# EAGLE design 18F2550 Trainer (EAGLE 5.11)
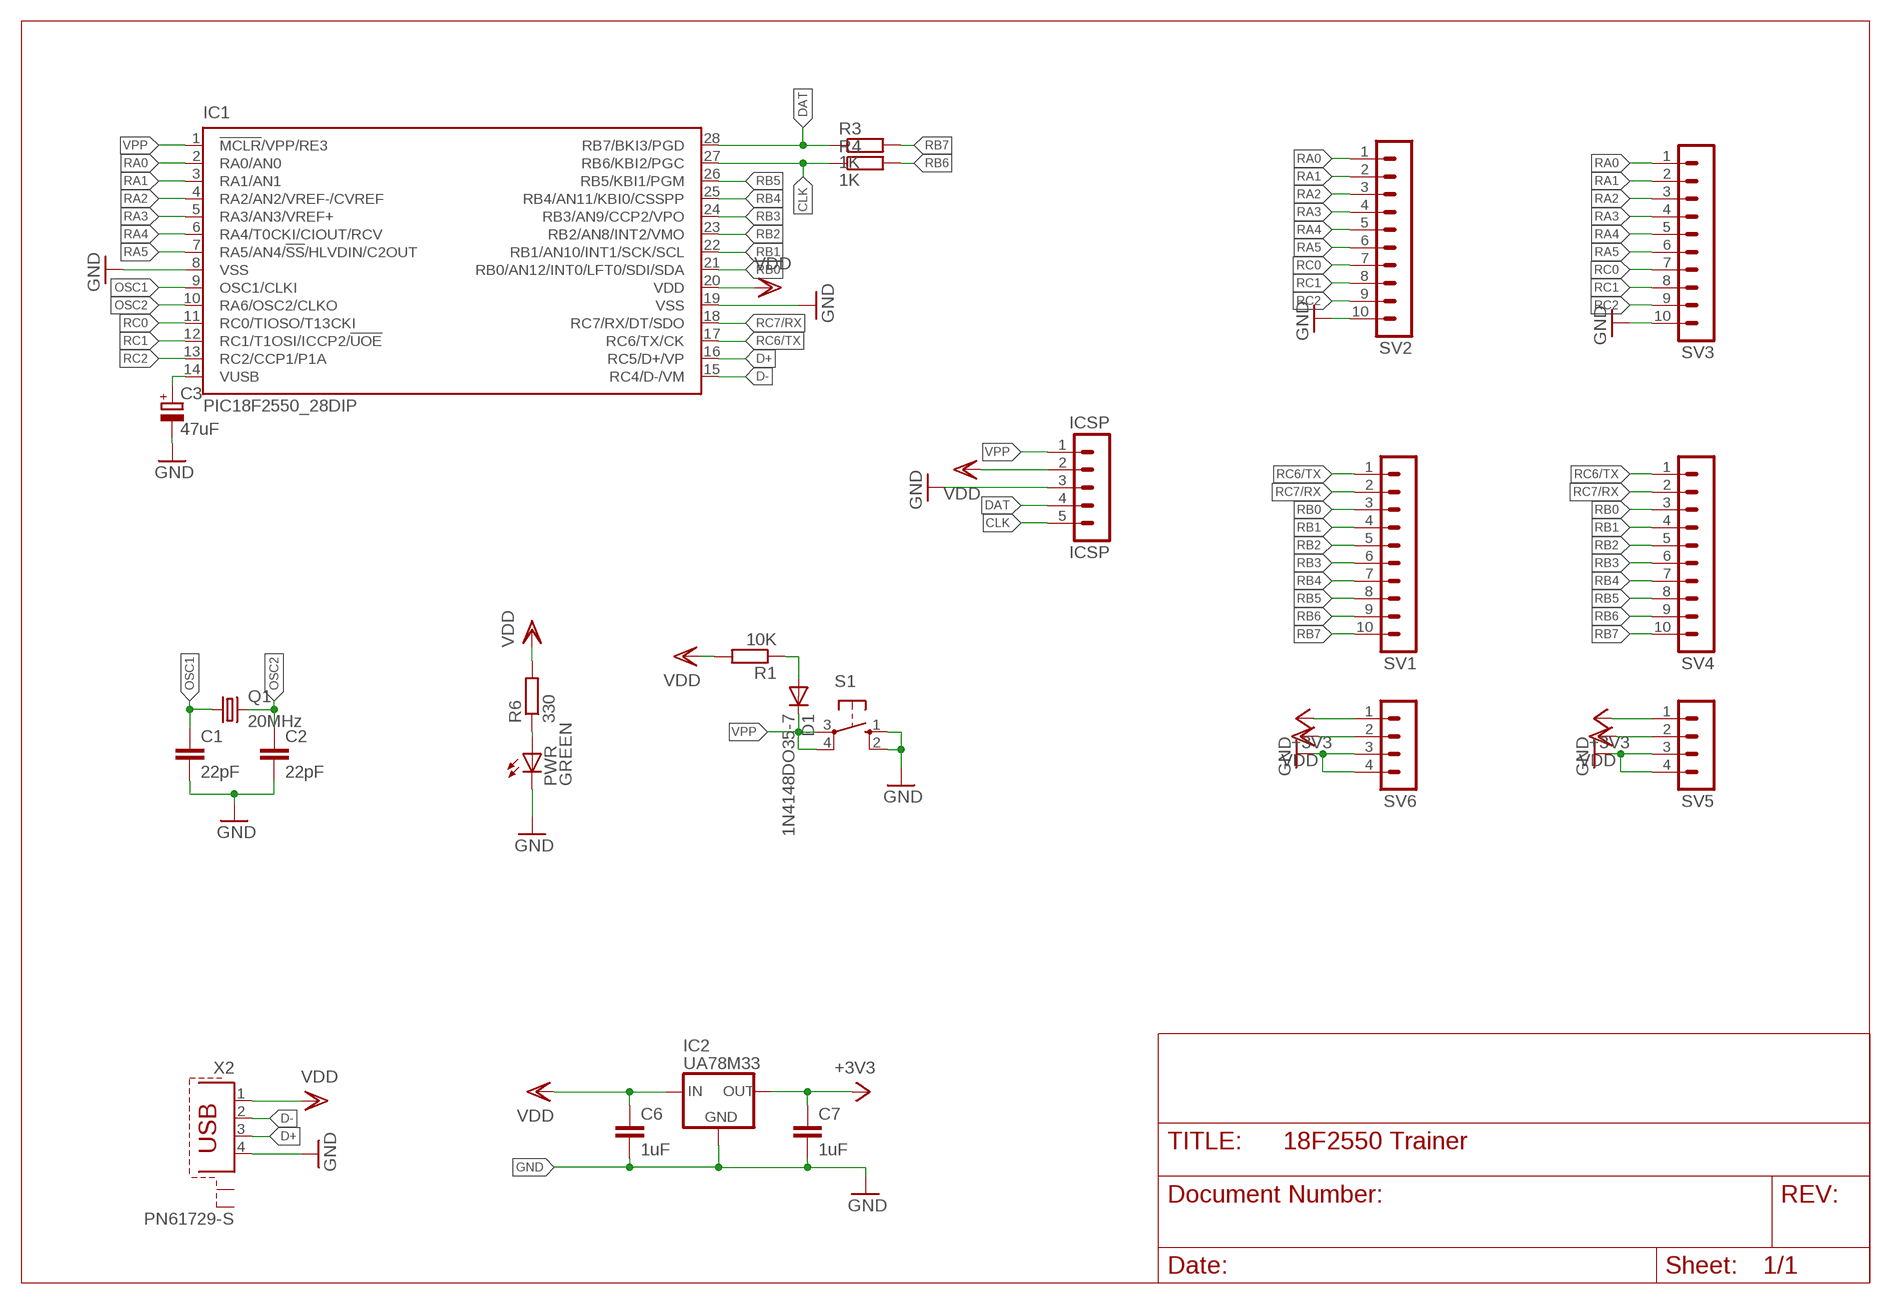
[diagram p0: schematic, sheet 1]

## Parts
C1  22pF  C-EU025-025X050  [C025-025X050]
C2  22pF  C-EU025-025X050  [C025-025X050]
C3  47uF  CPOL-EUE2-5  [E2-5]
C6  1uF  C-EU025-025X050  [C025-025X050]
C7  1uF  C-EU025-025X050  [C025-025X050]
D1  1N4148DO35-7  [DO35-7]
IC1  PIC18F2550_28DIP  [DIL28-3]
IC2  UA78M33  78LXXDPACK  [DPACK]
ICSP  ICSP  MA05-1  [MA05-1]
PWR  GREEN  LED3MM  [LED3MM]
Q1  20MHz  CRYSTALHC49S  [HC49/S]
R1  10K  R-EU_0207/7  [0207/7]
R3  1K  R-EU_0207/7  [0207/7]
R4  1K  R-EU_0207/7  [0207/7]
R6  330  R-EU_0207/7  [0207/7]
S1  10-XX  [B3F-10XX]
SV1  MA10-1  [MA10-1]
SV2  MA10-1  [MA10-1]
SV3  MA10-1  [MA10-1]
SV4  MA10-1  [MA10-1]
SV5  MA04-1  [MA04-1]
SV6  MA04-1  [MA04-1]
X2  PN61729-S  [PN61729-S]

## Nets
+3V3: C7.1 IC2.3(OUT) SV5.1 SV6.1
CLK: IC1.27(RB6/KBI2/PGC) ICSP.5 R4.1
D+: IC1.16(RC5/D+/VP) X2.3
D-: IC1.15(RC4/D-/VM) X2.2
DAT: IC1.28(RB7/BKI3/PGD) ICSP.4 R3.1
GND: C1.2 C2.2 C3.- C6.2 C7.2 IC1.8(VSS) IC1.19(VSS) IC2.4(GND) ICSP.3 PWR.K(C) S1.1(S) S1.2(S1) SV2.10 SV3.10 SV5.3 SV5.4 SV6.3 SV6.4 X2.4
N$1: C3.+ IC1.14(VUSB)
N$6: D1.A R1.1
N$10: PWR.A R6.1
OSC1: C1.1 IC1.9(OSC1/CLKI) Q1.1
OSC2: C2.1 IC1.10(RA6/OSC2/CLKO) Q1.2
RA0: IC1.2(RA0/AN0) SV2.1 SV3.1
RA1: IC1.3(RA1/AN1) SV2.2 SV3.2
RA2: IC1.4(RA2/AN2/VREF-/CVREF) SV2.3 SV3.3
RA3: IC1.5(RA3/AN3/VREF+) SV2.4 SV3.4
RA4: IC1.6(RA4/T0CKI/CIOUT/RCV) SV2.5 SV3.5
RA5: IC1.7(RA5/AN4/!SS!/HLVDIN/C2OUT) SV2.6 SV3.6
RB0: IC1.21(RB0/AN12/INT0/LFT0/SDI/SDA) SV1.3 SV4.3
RB1: IC1.22(RB1/AN10/INT1/SCK/SCL) SV1.4 SV4.4
RB2: IC1.23(RB2/AN8/INT2/VMO) SV1.5 SV4.5
RB3: IC1.24(RB3/AN9/CCP2/VPO) SV1.6 SV4.6
RB4: IC1.25(RB4/AN11/KBI0/CSSPP) SV1.7 SV4.7
RB5: IC1.26(RB5/KBI1/PGM) SV1.8 SV4.8
RB6: R4.2 SV1.9 SV4.9
RB7: R3.2 SV1.10 SV4.10
RC0: IC1.11(RC0/TIOSO/T13CKI) SV2.7 SV3.7
RC1: IC1.12(RC1/T1OSI/ICCP2/!UOE) SV2.8 SV3.8
RC2: IC1.13(RC2/CCP1/P1A) SV2.9 SV3.9
RC6/TX: IC1.17(RC6/TX/CK) SV1.1 SV4.1
RC7/RX: IC1.18(RC7/RX/DT/SDO) SV1.2 SV4.2
VDD: C6.1 IC1.20(VDD) IC2.1(IN) ICSP.2 R1.2 R6.2 SV5.2 SV6.2 X2.1
VPP: D1.C IC1.1(!MCLR!/VPP/RE3) ICSP.1 S1.3(P) S1.4(P1)
Unconnected: X2.S1 X2.S2

## Library data of the parts
C1 C2 C6 C7 = rcl:C-EU: CAPACITOR, European symbol
C3 = rcl:CPOL-EU: POLARIZED CAPACITOR, European symbol
D1 = diode:1N4148: DIODE high speed (Philips)
IC1 = microchip:PIC18F2*_28: USB Microcontrollers with nanoWatt Technology High-Performance, Enhanced Flash, 28/40/44-Pin, Source: http://ww1.microchip.com/downloads/en/devicedoc/39632c.pdf; MF: MICROCHIP; MPN: PIC18F2550-I/SP; OC_FARNELL: 1523822; OC_NEWARK: 80K6054
IC2 = v-reg:78LXX: VOLTAGE REGULATOR
ICSP = con-lstb:MA05-1: PIN HEADER; OC_FARNELL: unknown; OC_NEWARK: unknown
PWR = led:LED: LED OSRAM: - CHIPLED LG R971, LG N971, LY N971, LG Q971, LY Q971, LO R971, LY R971 LH N974, LH R974 LS Q976, LO Q976, LY Q976 LO Q996 - Hyper CHIPLED LW Q18S LB Q993, LB Q99A, LB R99A - SideLED LS A670, LO A670, LY A670, LG A670, LP A670 LB A673, LV A673, LT A673, LW A673 LH A674 LY A675 LS A676, LA A676, LO A676, LY A676, LW A676 LS A679, LY A679, LG A679 - Hyper Micro SIDELED® LS Y876, LA Y876, LO Y876, LY Y876 LT Y87S - SmartLED LW L88C, LW L88S LB L89C, LB L89S, LG L890 LS L89K, LO L89K, LY L89K LS L896, LA L896, LO L896, LY L896 - TOPLED LS T670, LO T670, LY T670, LG T670, LP T670 LSG T670, LSP T670, LSY T670, LOP T670, LYG T670 LG T671, LOG T671, LSG T671 LB T673, LV T673, LT T673, LW T673 LH T674 LS T676, LA T676, LO T676, LY T676, LB T676, LH T676, LSB T676, LW T676 LB T67C, LV T67C, LT T67C, LS T67K, LO T67K, LY T67K, LW E67C LS E67B, LA E67B, LO E67B, LY E67B, LB E67C, LV E67C, LT E67C LW T67C LS T679, LY T679, LG T679 LS T770, LO T770, LY T770, LG T770, LP T770 LB T773, LV T773, LT T773, LW T773 LH T774 LS E675, LA E675, LY E675, LS T675 LS T776, LA T776, LO T776, LY T776, LB T776 LHGB T686 LT T68C, LB T68C - Hyper Mini TOPLED® LB M676 - Mini TOPLED Santana® LG M470 LS M47K, LO M47K, LY M47K Source: http://www.osram.convergy.de LUXEON: - LUMILED® LXK2-PW12-R00, LXK2-PW12-S00, LXK2-PW14-U00, LXK2-PW14-V00 LXK2-PM12-R00, LXK2-PM12-S00, LXK2-PM14-U00 LXK2-PE12-Q00, LXK2-PE12-R00, LXK2-PE12-S00, LXK2-PE14-T00, LXK2-PE14-U00 LXK2-PB12-K00, LXK2-PB12-L00, LXK2-PB12-M00, LXK2-PB14-N00, LXK2-PB14-P00, LXK2-PB14-Q00 LXK2-PR12-L00, LXK2-PR12-M00, LXK2-PR14-Q00, LXK2-PR14-R00 LXK2-PD12-Q00, LXK2-PD12-R00, LXK2-PD12-S00 LXK2-PH12-R00, LXK2-PH12-S00 LXK2-PL12-P00, LXK2-PL12-Q00, LXK2-PL12-R00 Source: www.luxeon.com KINGBRIGHT: KA-3528ASYC Source: www.kingbright.com
Q1 = crystal:CRYSTAL: CRYSTAL; OC_FARNELL: 1667008; OC_NEWARK: unknown
R1 R3 R4 R6 = rcl:R-EU_: RESISTOR, European symbol
S1 = switch-omron:10-XX: OMRON SWITCH; MPN: B3F-1000; OC_FARNELL: 176432; OC_NEWARK: 36M3542
SV1-SV4 = con-lstb:MA10-1: PIN HEADER; OC_FARNELL: unknown; OC_NEWARK: unknown
SV5 SV6 = con-lstb:MA04-1: PIN HEADER; OC_FARNELL: unknown; OC_NEWARK: unknown
X2 = con-berg:PN61729-S: BERG USB connector; OC_FARNELL: unknown; OC_NEWARK: unknown

## Board
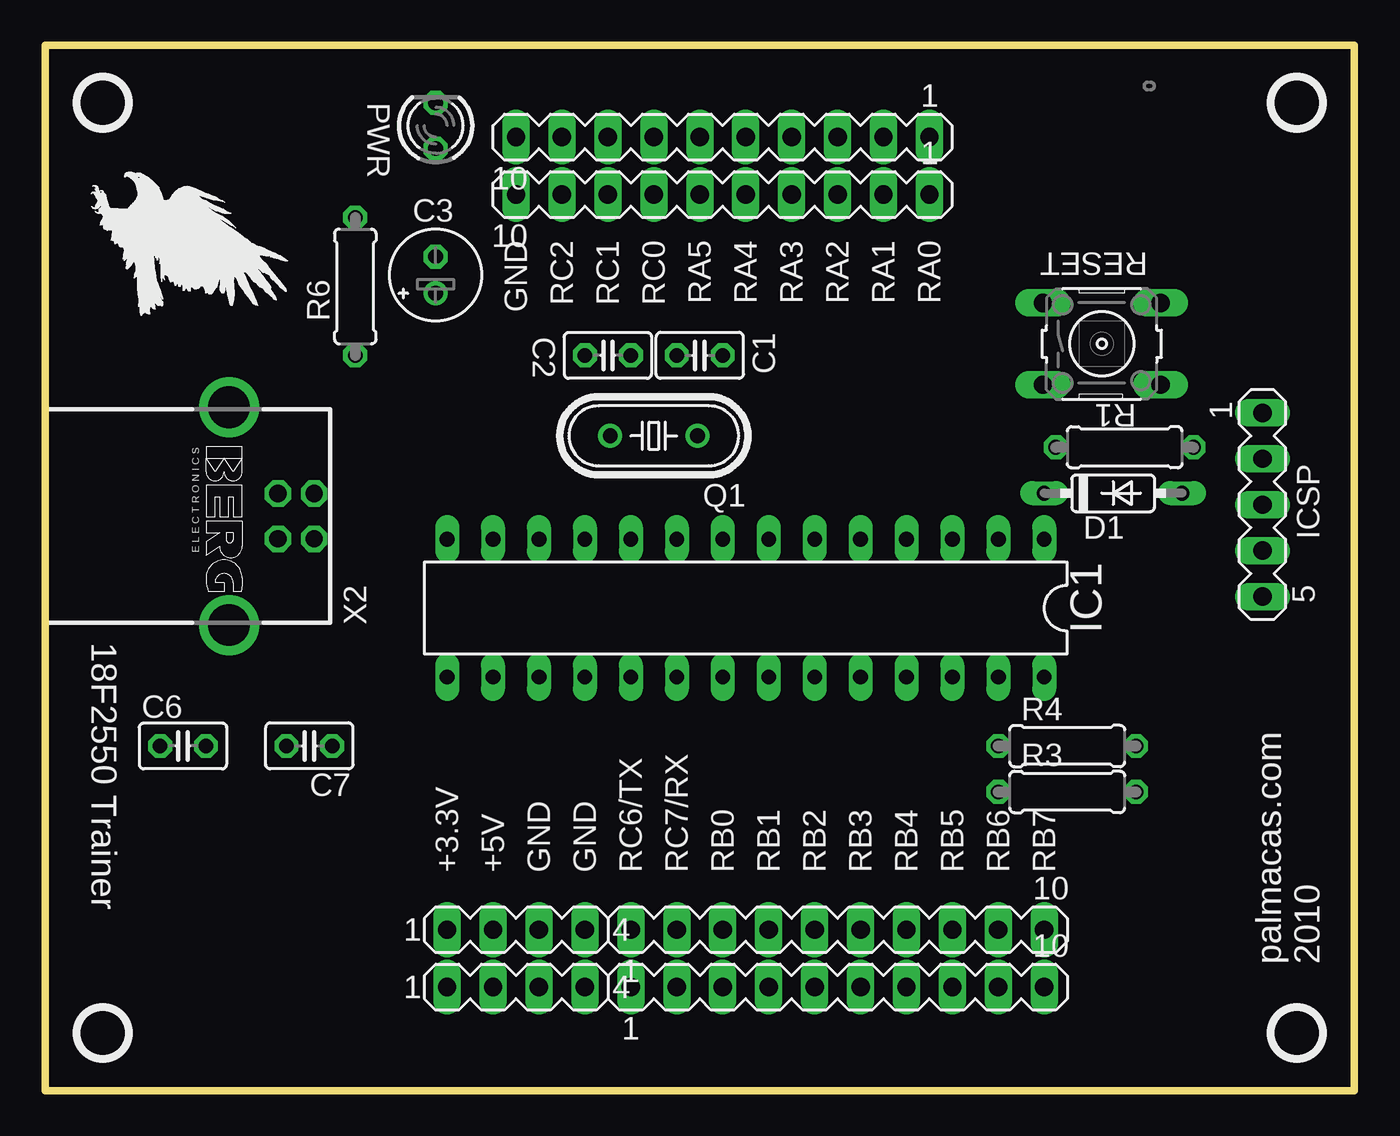
[diagram p1: board, top side]
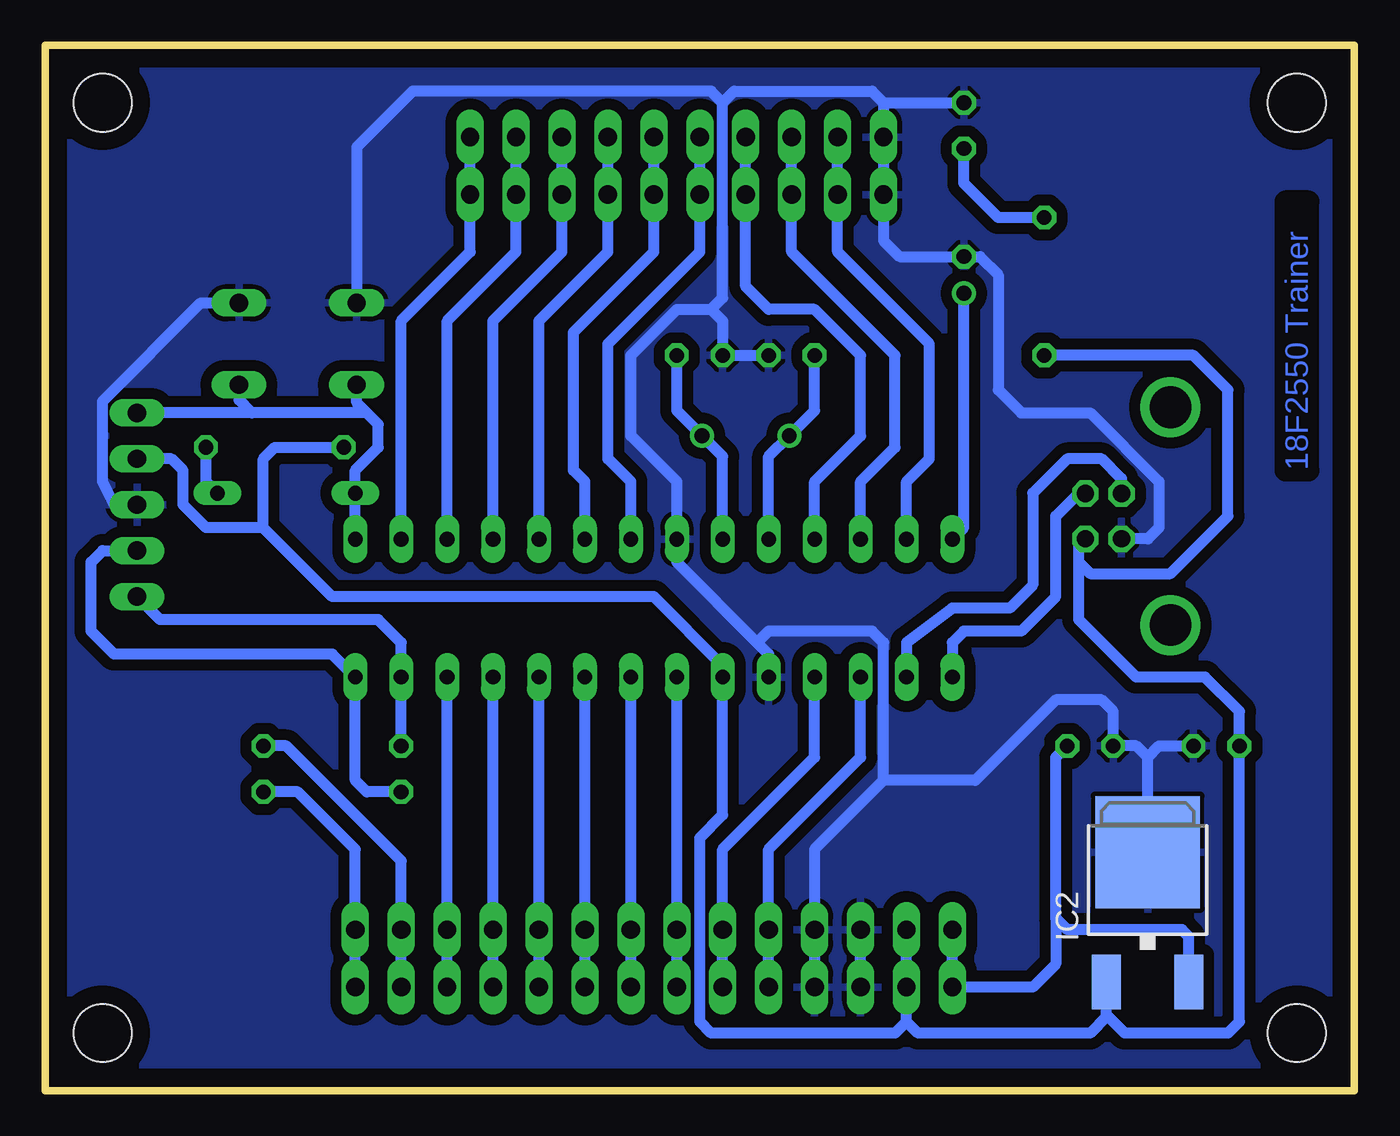
[diagram p2: board, bottom side, seen from below]

Size 72.39 x 57.78 mm. Coordinates in mm from the lower left corner, seen from the top.
Outline: 0,0 72.39,0 72.39,57.78 0,57.78 0,0
Copper layers (1*16): Top 0.035mm / dielectric 1.5mm / Bottom 0.035mm
Design rules "default": minimum track width 10mil, minimum drill 24mil, track to track 8mil, track to pad 8mil, pad to pad 8mil, via to via 8mil, smd to smd 8mil, copper to edge 40mil, drill to drill 8mil, minimum pad ring 10mil, minimum via ring 8mil, stop-mask expansion 4mil, vias tented up to drill 0mil, thermal gap 10mil
Holes 3.2 mm at 3.17,54.61 69.22,54.61 69.22,3.17 3.17,3.17

### Footprints (pad centres in the part's own frame; a part is rotated, then mirrored left to right if it is on the bottom)
C025-025X050 = drill 0.813 octagon: 1 -1.27,0; 2 1.27,0
E2-5 = drill 0.813 pad 1.27: + -1.016,0 | drill 0.813 pad 1.27 octagon: - 1.016,0
DO35-7 = drill 0.813 long: A 3.81,0; C -3.81,0
DIL28-3 = drill 0.813 long: 1 -16.51,-3.81; 2 -13.97,-3.81; 3 -11.43,-3.81; 4 -8.89,-3.81; 5 -6.35,-3.81; 6 -3.81,-3.81; 7 -1.27,-3.81; 8 1.27,-3.81; 9 3.81,-3.81; 10 6.35,-3.81; 11 8.89,-3.81; 12 11.43,-3.81; 13 13.97,-3.81; 14 16.51,-3.81; 15 16.51,3.81; 16 13.97,3.81; 17 11.43,3.81; 18 8.89,3.81; 19 6.35,3.81; 20 3.81,3.81; 21 1.27,3.81; 22 -1.27,3.81; 23 -3.81,3.81; 24 -6.35,3.81; 25 -8.89,3.81; 26 -11.43,3.81; 27 -13.97,3.81; 28 -16.51,3.81
DPACK = smd 1.6 x 3: 1 -2.28,-4.8; 3 2.28,-4.8 | smd 5.8 x 6.2: 4 0,2.38
MA05-1 = drill 1.016 long: 1 -5.08,0; 2 -2.54,0; 3 0,0; 4 2.54,0; 5 5.08,0
LED3MM = drill 0.813 octagon: A -1.27,0; K 1.27,0
HC49/S = drill 0.813: 1 -2.413,0; 2 2.413,0
0207/7 = drill 0.813 octagon: 1 -3.81,0; 2 3.81,0
B3F-10XX = drill 1.016 long: 1 -3.251,2.261; 2 3.251,2.261; 3 -3.251,-2.261; 4 3.251,-2.261
MA10-1 = drill 1.016 long: 1 -11.43,0; 2 -8.89,0; 3 -6.35,0; 4 -3.81,0; 5 -1.27,0; 6 1.27,0; 7 3.81,0; 8 6.35,0; 9 8.89,0; 10 11.43,0
MA04-1 = drill 1.016 long: 1 -3.81,0; 2 -1.27,0; 3 1.27,0; 4 3.81,0
PN61729-S = drill 0.95 octagon: 1 1.25,4.71; 2 -1.25,4.71; 3 -1.25,2.71; 4 1.25,2.71 | drill 2.3 pad 2.9: S1 -6.02,0; S2 6.02,0

### Placement (x,y rotation side)
C1  36.2,40.64 180 top
C2  31.11,40.64 0 top
C3  21.59,45.09 90 top
C6  7.62,19.05 0 top
C7  14.61,19.05 180 top
D1  59.05,33.02 0 top
IC1  38.73,26.67 180 top
IC2  11.43,10.79 0 bottom
ICSP  67.31,32.38 270 top
PWR  21.59,53.34 90 top
Q1  33.66,36.2 180 top
R1  59.69,35.56 180 top
R3  56.52,16.51 0 top
R4  56.52,19.05 0 top
R6  17.14,44.45 270 top
S1  58.42,41.27 0 top
SV1  43.81,8.89 0 top
SV2  37.47,49.53 180 top
SV3  37.47,52.7 180 top
SV4  43.81,5.71 0 top
SV5  26.04,8.89 0 top
SV6  26.04,5.71 0 top
U$1  [EAGLE-PLC-8MM]  2.54,50.8 270 top
U$2  [LOGO]  64.77,55.88 180 top
X2  10.16,31.75 270 top

### Tracks (layer width: path | path; a pad name or v marks a point on that pad's centre or on a via)
+3V3
  Bottom 0.61: SV5.1 SV6.1 17.78,5.71 16.51,6.99 16.51,9.53 | 16.51,9.53 16.51,18.41 C7.1 | IC2.3 9.15,8.52 9.53,8.89 15.88,8.89 16.51,9.53
CLK
  Bottom 0.61: R4.1 IC1.27 52.7,24.77 53.98,26.04 66.04,26.04 ICSP.5
D+
  Bottom 0.61: X2.3 12.87,33.83 13.97,34.92 15.88,34.92 17.78,33.02 17.78,27.94 19.05,26.67 22.23,26.67 24.77,24.77 IC1.16
D-
  Bottom 0.61: X2.2 15.26,33 16.51,31.75 16.51,27.3 18.41,25.4 21.59,25.4 22.23,24.77 IC1.15
DAT
  Bottom 0.61: R3.1 54.61,16.51 55.24,17.14 IC1.28 56.52,24.13 68.58,24.13 69.85,25.4 69.85,29.21 69.22,29.84 ICSP.4
GND
  Bottom 0.61: C2.2 C1.2 34.92,42.55 35.56,43.18 | 35.56,43.18 37.47,43.18 40.01,40.64 40.01,36.2 37.47,33.66 IC1.8 37.47,29.21 33.02,24.77 | 26.04,54.61 SV3.10 SV2.10 26.04,46.99 25.15,46.1 C3.- 20.7,46.1 19.68,45.09 19.68,38.73 18.41,37.47 14.61,37.47 10.79,33.66 10.79,31.11 11.41,30.5 X2.4 | 26.04,54.61 26.67,55.24 34.29,55.24 34.92,54.61 | 34.92,54.61 34.92,43.81 35.56,43.18 | S1.1 55.17,52.15 52.07,55.24 35.56,55.24 34.92,54.61 | 26.04,54.61 PWR.K | 26.04,17.14 29.84,13.34 SV5.4 SV6.4 | 26.04,17.14 26.04,24.77 26.67,25.4 32.38,25.4 33.02,24.77 | IC1.19 32.38,24.13 33.02,24.77 | ICSP.3 68.58,32.38 69.22,33.66 69.22,38.1 63.78,43.54 S1.2 | SV6.3 SV5.3 | 11.43,18.41 10.79,19.05 C6.2 | IC2.4 11.43,18.41 | 11.43,18.41 12.06,19.05 C7.2 13.34,20.95 13.97,21.59 16.51,21.59 20.95,17.14 26.04,17.14
  pour Bottom (isolate 0.61): 0,0 72.39,0 72.39,57.78 0,57.78
N$1
  Bottom 0.61: IC1.14 21.59,31.11 C3.+
N$6
  Bottom 0.61: R1.1 63.5,33.66 D1.A
N$10
  Bottom 0.61: R6.1 19.68,48.26 21.59,50.16 PWR.A
OSC1
  Bottom 0.61: C1.1 37.47,37.59 Q1.1 34.92,35.05 IC1.9
OSC2
  Bottom 0.61: C2.1 29.84,37.59 Q1.2 32.38,35.05 IC1.10
RA0
  Bottom 0.61: IC1.2 52.7,42.55 48.9,46.35 SV2.1 SV3.1
RA1
  Bottom 0.61: IC1.3 50.16,42.55 46.35,46.35 SV2.2 SV3.2
RA2
  Bottom 0.61: IC1.4 47.62,42.55 43.81,46.35 SV2.3 SV3.3
RA3
  Bottom 0.61: IC1.5 45.09,42.55 41.27,46.35 SV2.4 SV3.4
RA4
  Bottom 0.61: IC1.6 42.55,33.66 43.18,34.29 43.18,41.91 38.73,46.35 SV2.5 SV3.5
RA5
  Bottom 0.61: IC1.7 40.01,33.66 41.27,34.92 41.27,41.27 36.2,46.35 SV2.6 SV3.6
RB0
  Bottom 0.61: IC1.21 SV1.3 SV4.3
RB1
  Bottom 0.61: SV4.4 SV1.4 IC1.22
RB2
  Bottom 0.61: IC1.23 SV1.5 SV4.5
RB3
  Bottom 0.61: IC1.24 SV1.6 SV4.6
RB4
  Bottom 0.61: IC1.25 SV1.7 SV4.7
RB5
  Bottom 0.61: IC1.26 SV1.8 SV4.8
RB6
  Bottom 0.61: R4.2 59.05,19.05 52.7,12.7 SV1.9 SV4.9
RB7
  Bottom 0.61: SV4.10 SV1.10 55.24,13.34 58.42,16.51 R3.2
RC0
  Bottom 0.61: IC1.11 29.84,33.66 27.3,36.2 27.3,40.64 29.84,43.18 32.38,43.18 33.66,44.45 SV2.7 SV3.7
RC1
  Bottom 0.61: IC1.12 27.3,33.66 25.4,35.56 25.4,40.64 31.11,46.35 SV2.8 SV3.8
RC2
  Bottom 0.61: IC1.13 24.77,33.66 23.5,34.92 23.5,41.27 28.57,46.35 SV2.9 SV3.9
RC6/TX
  Bottom 0.61: SV4.1 SV1.1 32.38,13.34 27.3,18.41 IC1.17
RC7/RX
  Bottom 0.61: IC1.18 29.84,18.41 34.92,13.34 SV1.2 SV4.2
VDD
  Bottom 0.61: 60.33,31.11 56.52,27.3 38.73,27.3 34.92,23.5 IC1.20 34.92,15.24 36.2,13.97 36.2,3.81 35.56,3.17 25.4,3.17 24.77,3.81 | 24.77,3.81 SV6.2 SV5.2 | 24.77,3.81 24.13,3.17 14.61,3.17 13.71,4.07 13.71,4.18 | 15.24,29.21 15.24,26.04 12.06,22.86 8.26,22.86 6.35,20.95 C6.1 6.35,3.81 6.99,3.17 12.7,3.17 13.71,4.18 | 15.24,29.21 15.24,30.13 X2.1 | R6.2 8.89,40.64 6.99,38.73 6.99,31.75 10.16,28.57 14.61,28.57 15.24,29.21 | R1.2 59.69,35.56 60.33,34.92 60.33,31.11 | 60.33,31.11 63.5,31.11 64.77,32.38 64.77,34.29 65.41,34.92 ICSP.2 | 13.71,4.18 IC2.1
VPP
  Bottom 0.61: IC1.1 D1.C 55.24,34.29 53.98,35.56 53.98,36.83 54.61,37.47 | S1.3 55.17,38.02 54.61,37.47 | 54.61,37.47 60.96,37.47 | 60.96,37.47 ICSP.1 | S1.4 61.67,38.18 60.96,37.47
(copper drawn outside any net)
  shapes: Bottom circle x4

### Text on the board
Bottom: 18F2550 Trainer
tPlace: PWR | GND | RC2 | RC1 | RC0 | RA5 | RA4 | RA3 | RA2 | RA1 | RA0 | RESET | ICSP | 18F2550 Trainer | +3.3V | +5V | GND | GND | RC6/TX | RC7/RX | RB0 | RB1 | RB2 | RB3 | RB4 | RB5 | RB6 | RB7 | palmacas.com / 2010